# EasyEDA schematic 原理图.json
TITLE: Sheet_1; REV: 1.0; Date: 2021-03-02; Sheet: 1/1; Drawn By: pomin; Company: Your Company
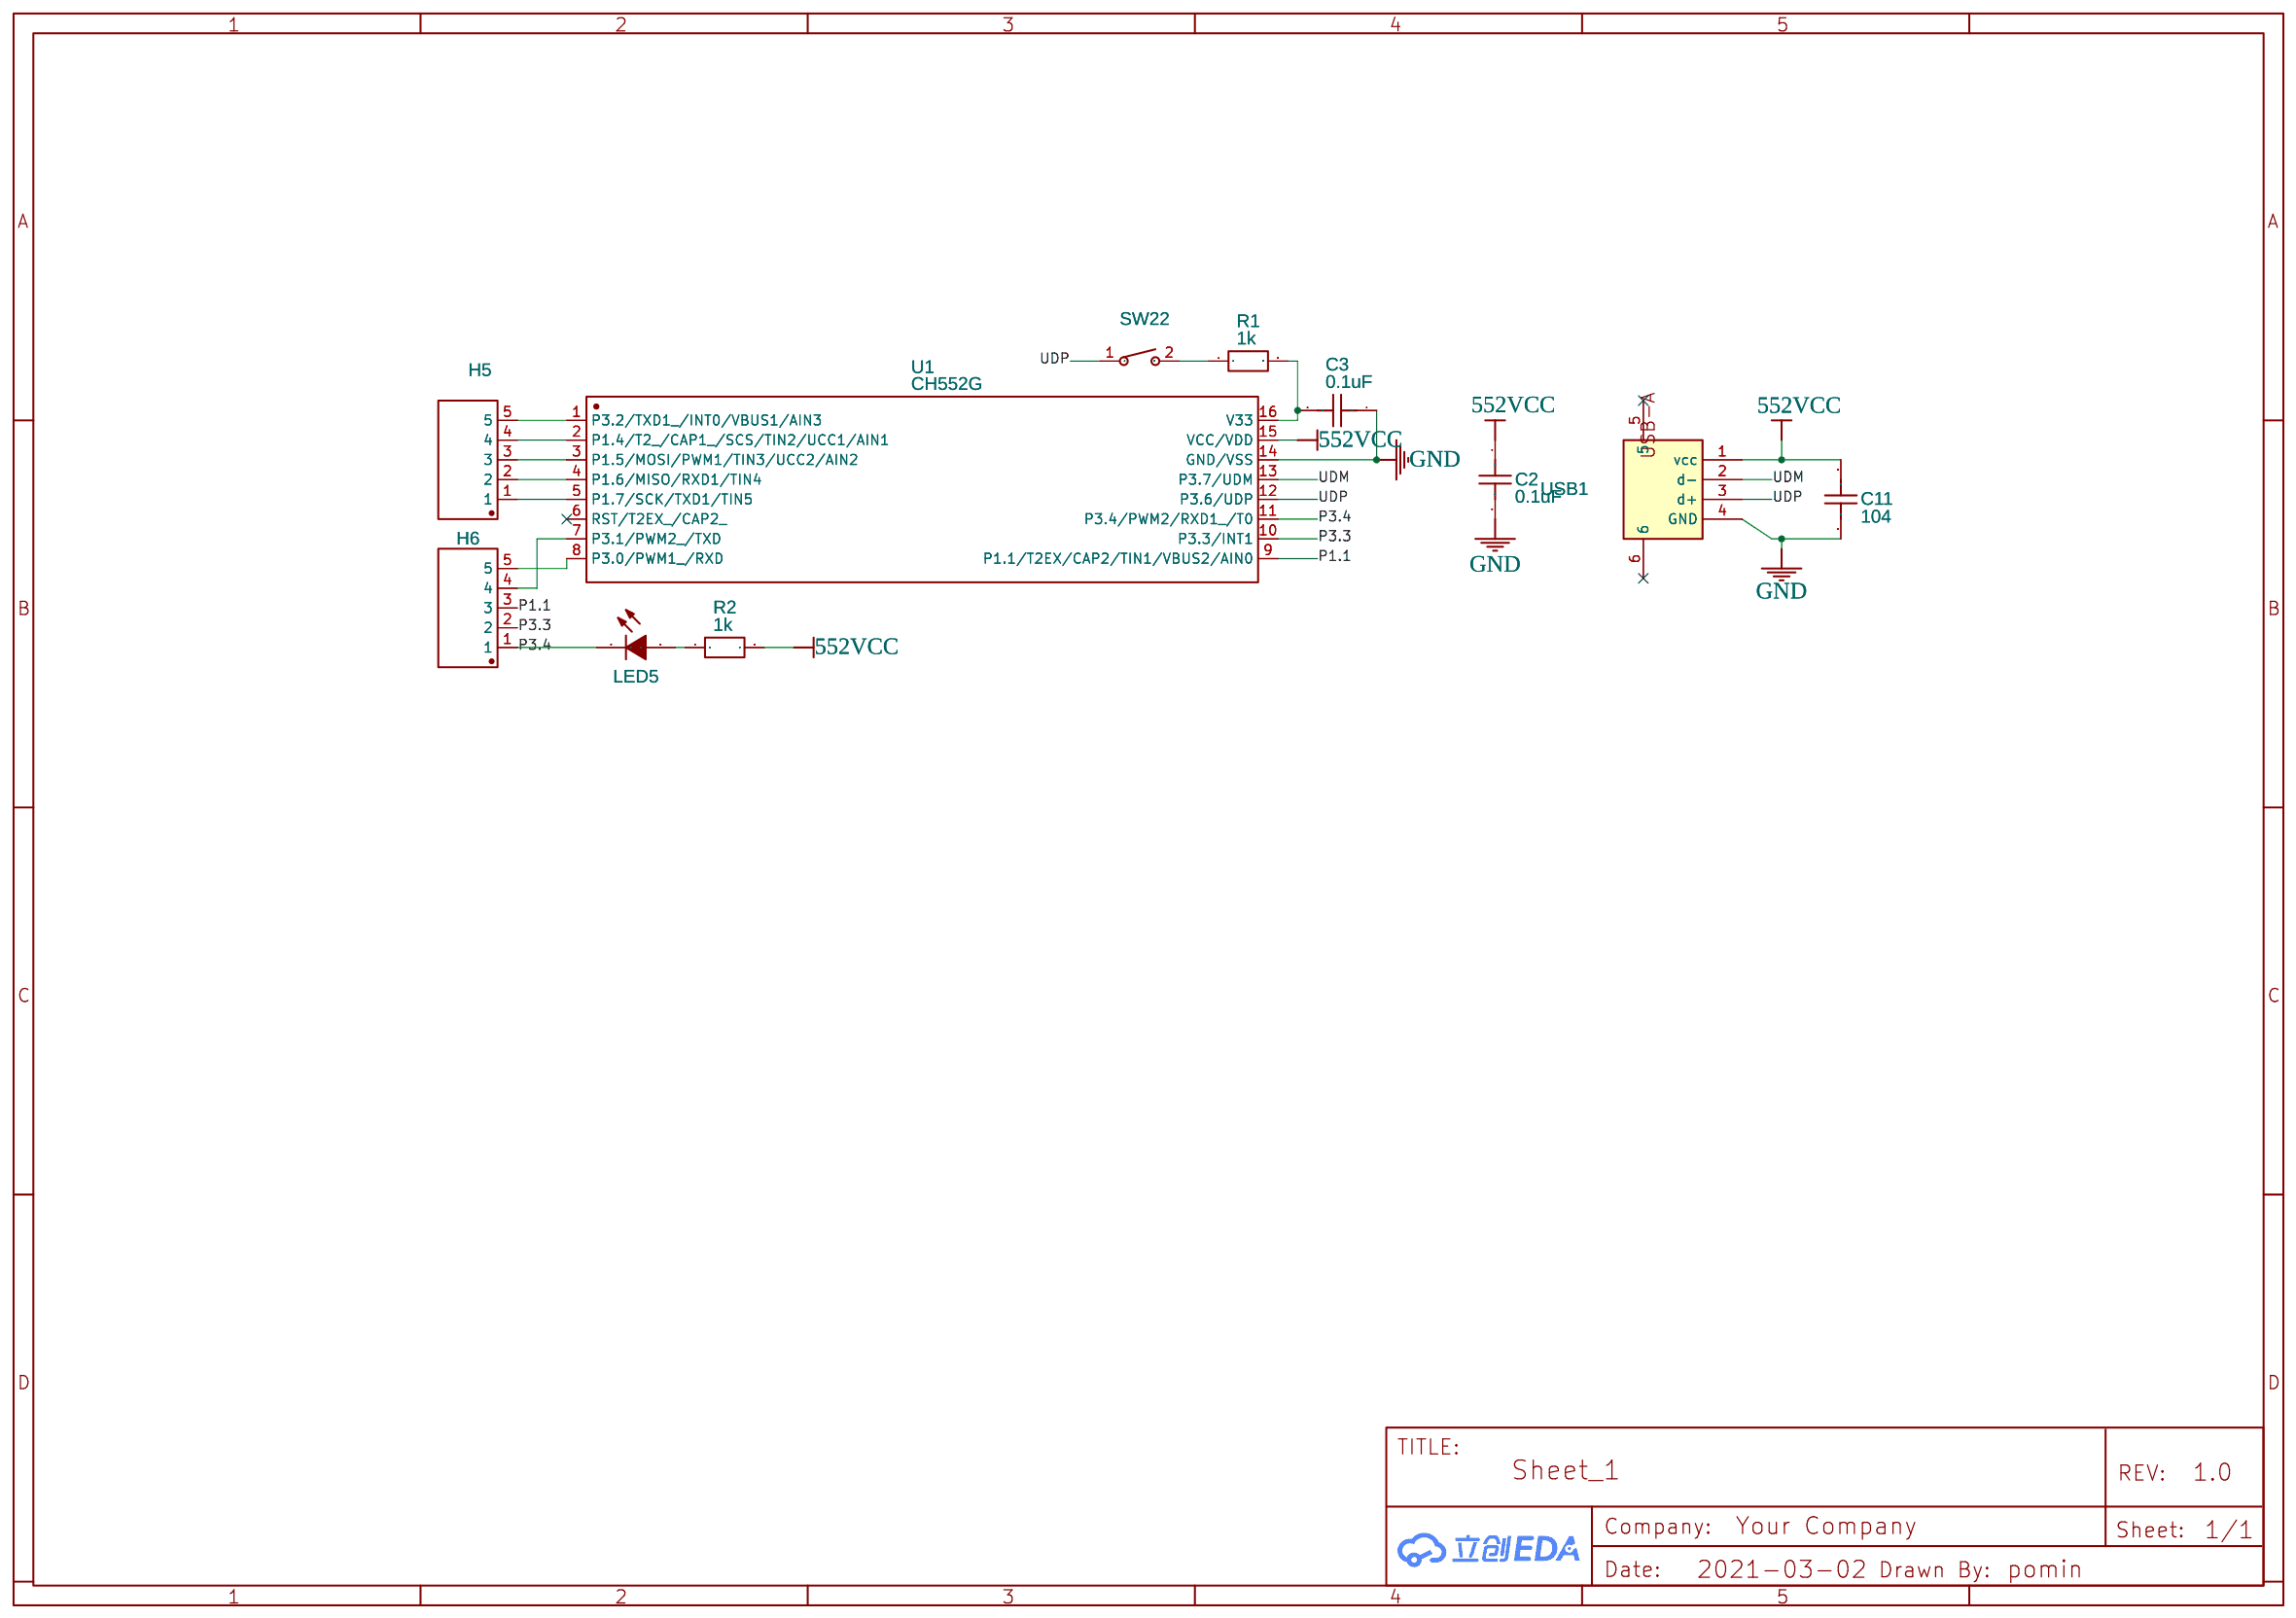
[diagram p0: schematic sheet]

## Parts
C2  0.1uF  [C0805]
C3  0.1uF  [C0805]
C11  104  [C0805]
H5  210S-1*5P L=11.6MMGold-plated black  [HDR-TH_5P-P2.54-V]
H6  210S-1*5P L=11.6MMGold-plated black  [HDR-TH_5P-P2.54-V]
LED5  17-21SURC/S530-A3/TR8  [LED0805-R-RD]
R1  1k  [R0805]
R2  1k  [R0805]
SW22  UK-B0227-G4.3-160-W-JZ  [SW-SMD_L6.0-W3.5-LS8.0]
U1  CH552G  [SOP-16_L10.0-W3.9-P1.27-LS6.0-BL]
USB1  U-G-04WS-W-01  [USB-A-SMD_U-G-04WS-W-01]

## Library data of the parts
C2 C3 = C_0201_US: Contributor: LCEDA_Lib
C11 = C_0805_US: Contributor: LCEDA_Lib
H5 H6 = 210S-1*5P L=11.6MMGold-plated black: Supplier: LCSC; Manufacturer: Ckmtw; Contributor: LCSC; Supplier Part: C124379; JLCPCB SMD: Yes; SMT Type: Extend
LED5 = 17-21SURC/S530-A3/TR8: Supplier: LCSC; Manufacturer: EVERLIGHT; image: //image.lceda.cn/szlcsc/C72037.jpg; Supplier Part: C72037; SMT Type: Extend; JLCPCB SMD: Yes
R1 R2 = R_0201_EU: Contributor: LCEDA_Lib
SW22 = UK-B0227-G4.3-160-W-JZ: Supplier: LCSC; Supplier Part: C620345; Manufacturer: USAKRO; Contributor: LCSC
U1 = CH552G: Supplier: LCSC; Manufacturer: WCH; Supplier Part: C111292; SMT Type: Extend; JLCPCB SMD: Yes
USB1 = U-G-04WS-W-01: Supplier: LCSC; Manufacturer: HRO; Supplier Part: C97324

## Nets
552VCC: C2.1 C11.2 R2.2 U1.15(VCC/VDD) USB1.1(vcc)
GND: C2.2 C3.1 C11.1 U1.14(GND/VSS) USB1.4(GND)
P1.1: H6.3 U1.9(P1.1/T2EX/CAP2/TIN1/VBUS2/AIN0)
P3.3: H6.2 U1.10(P3.3/INT1)
P3.4: H6.1 LED5.2(C) U1.11(P3.4/PWM2/RXD1_/T0)
UDM: U1.13(P3.7/UDM) USB1.2(d-)
UDP: SW22.1 U1.12(P3.6/UDP) USB1.3(d+)
Net-(C3-2): C3.2 R1.2 U1.16(V33)
Net-(H5-1): H5.1 U1.5(P1.7/SCK/TXD1/TIN5)
Net-(H5-2): H5.2 U1.4(P1.6/MISO/RXD1/TIN4)
Net-(H5-3): H5.3 U1.3(P1.5/MOSI/PWM1/TIN3/UCC2/AIN2)
Net-(H5-4): H5.4 U1.2(P1.4/T2_/CAP1_/SCS/TIN2/UCC1/AIN1)
Net-(H5-5): H5.5 U1.1(P3.2/TXD1_/INT0/VBUS1/AIN3)
Net-(H6-4): H6.4 U1.7(P3.1/PWM2_/TXD)
Net-(H6-5): H6.5 U1.8(P3.0/PWM1_/RXD)
Net-(LED5-1): LED5.1(A) R2.1
Net-(R1-1): R1.1 SW22.2

Not connected (* = marked no-connect by the designer): U1 6(RST/T2EX_/CAP2_)*; USB1 5* 6*
